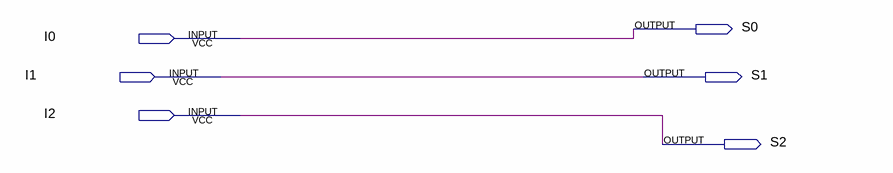
[diagram p0: schematic sheet]
// Quartus schematic ConvBarre3.bdf as structural Verilog: 0 symbols, 6 pins
module ConvBarre3 (
  input  I0,
  input  I1,
  input  I2,
  output S0,
  output S1,
  output S2
);


  assign S0 = I0;
  assign S1 = I1;
  assign S2 = I2;
endmodule
